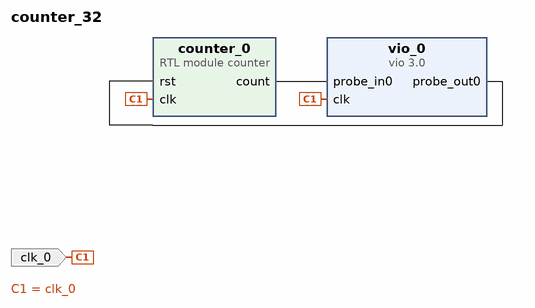
[diagram p0: block diagram of the top level]
# Vivado block design counter_32, xc7a35tcpg236-1, Vivado 2022.2
create_bd_design counter_32

create_bd_port -dir I -type clk clk_0

create_bd_cell -type ip -vlnv xilinx.com:ip:vio:3.0 vio_0
create_bd_cell -type module -reference counter counter_0

# ---- connections ----

connect_bd_net -net clk_0_1 [get_bd_ports clk_0] [get_bd_pins vio_0/clk] [get_bd_pins counter_0/clk]
connect_bd_net [get_bd_pins counter_0/count] [get_bd_pins vio_0/probe_in0]
connect_bd_net [get_bd_pins vio_0/probe_out0] [get_bd_pins counter_0/rst]

validate_bd_design
save_bd_design
